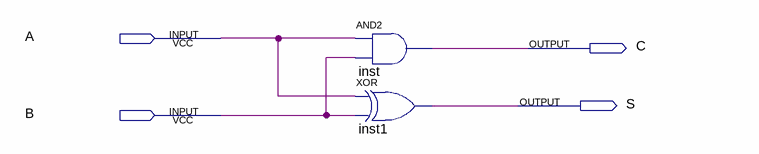
[diagram p0: schematic sheet]
// Quartus schematic Half_adder.bdf as structural Verilog: 2 symbols, 4 pins
module Half_adder (
  input  A,
  input  B,
  output C,
  output S
);

  and inst (C, A, B);
  xor inst1 (S, A, B);
endmodule
